# Altium schematic sheet ConnS1.SchDoc
size A; SheetNumber: 2; SheetTotal: 3
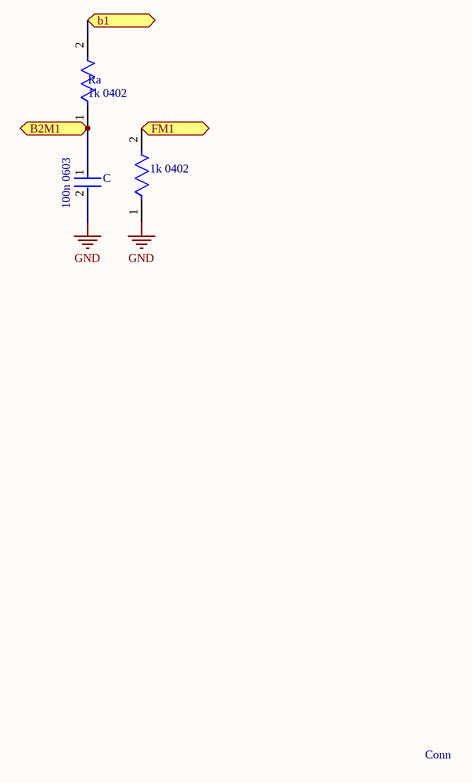
[diagram p0: ConnS1.SchDoc]

## Parts
C  100n 0603  [FP-C0603C-CF-MFG]
Ra  1k 0402  [FP-CR0402-IPC_C]
Rb?  1k 0402  [FP-CR0402-IPC_C]

## Ports
b1 (bidir), B2M1 (bidir), FM1 (bidir)

## Nets
GND: C.2 Rb?.1
b1: Ra.2 ; port b1
B2M1: C.1 Ra.1 ; port B2M1
FM1: Rb?.2 ; port FM1

## Notes on the sheet
- Conn

## Library data of the parts
C = CMP-2006-03811-3: Manufacturer Part Number: C0603C104K4RACTU; Manufacturer: KEMET; Value: 0.10 μF; Voltage Rating: 16 V; Temperature Coefficient: 30ppm/°C; Temperature Characteristic: X7R; Automotive Grade: Grade 1; Tolerance: 0.1; Digikey Description: Capacitor; Ceramic; Cap; .100uF; Tol 10%; SMT; Vol-Rtg 16V; X7R; Tape and Reel; Automotive: Yes; Temperature Range High: +125°C; Device Class L1: Passive Components; Material: Ceramic; Lead Free: Yes; Device Class L2: Capacitors; Capacitance: 0.10 μF; Height: 0.87mm; Octopart: https://octopart.com/c0603c104k4ractu-kemet-93067; Package: C0603C-CF; Device Class L3: Ceramic Capacitors; ComponentLink2URL: https://api.kemet.com/component-edge/download/datasheet/C0603C100J5GACAUTO.pdf; Temperature Range Low: -55°C; ComponentLink2Description: Datasheet; Mouser Description: Multilayer Ceramic Capacitors MLCC - SMD/SMT 16volts 0.1uF 10% X7R 10%; RoHS: TRUE; Temperature: -55°C to +125°C; Category: Cap
Ra Rb? = CMP-2002-04703-2: Thick Film Chip Resistors 0402 1kΩ 0.0625W 1% 100ppm/°C; Voltage Rating: 50V; Max Power Dissipation: 63mW; Resistance: 1kR; Power Rating: 62.5mW; Package Quantity: 10000; Radiation Hardening: No; Temperature Coefficient: 100ppm/°C; Number of Terminations: 2; Packaging: Tape and Reel; Thickness: 356um; Case Code (Metric): 1005; Case/Package: 0402; Case Code (Imperial): 0402; Max Operating Temperature: 155°C; Composition: Thick Film; Min Operating Temperature: -55°C; Mount: Surface Mount; Tolerance: 1%; Termination: SMD/SMT; Width: 0.02inch; Contact Plating: Tin; Height: 0.016inch; Length: 0.039inch